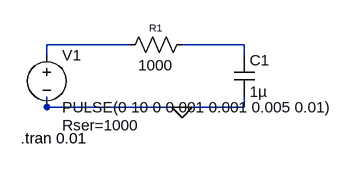
[diagram p0: schematic RC_Circuit.asc]
RC_Circuit.asc, the LTspice schematic file:
Version 4.1
SHEET 1 880 680
WIRE 192 112 64 112
WIRE 368 112 272 112
WIRE 64 128 64 112
WIRE 368 128 368 112
WIRE 64 208 64 192
WIRE 272 208 64 208
WIRE 368 208 368 192
WIRE 368 208 272 208
FLAG 272 208 0
SYMBOL voltage 64 112 R0
WINDOW 123 0 0 Left 0
WINDOW 39 24 124 Left 2
SYMATTR SpiceLine Rser=1000
SYMATTR InstName V1
SYMATTR Value PULSE(0 10 0 0.001 0.001 0.005 0.01)
SYMBOL cap 352 128 R0
SYMATTR InstName C1
SYMATTR Value 1µ
SYMATTR SpiceLine V=16
SYMBOL res 288 96 R90
WINDOW 0 0 56 VBottom 1
WINDOW 3 32 56 VTop 2
SYMATTR InstName R1
SYMATTR Value 1000
SYMATTR SpiceLine tol=1 pwr=0.1
TEXT 24 256 Left 2 !.tran 0.01

The netlist it stands for:
* RC_Circuit.asc
V1 N001 0 PULSE(0 10 0 0.001 0.001 0.005 0.01) Rser=1000
C1 N002 0 1µ V=16
R1 N002 N001 1000 tol=1 pwr=0.1
.tran 0.01
.backanno
.end